# Altium schematic sheet hv-supply.SchDoc
size A; SheetNumber: 9; SheetTotal: 9
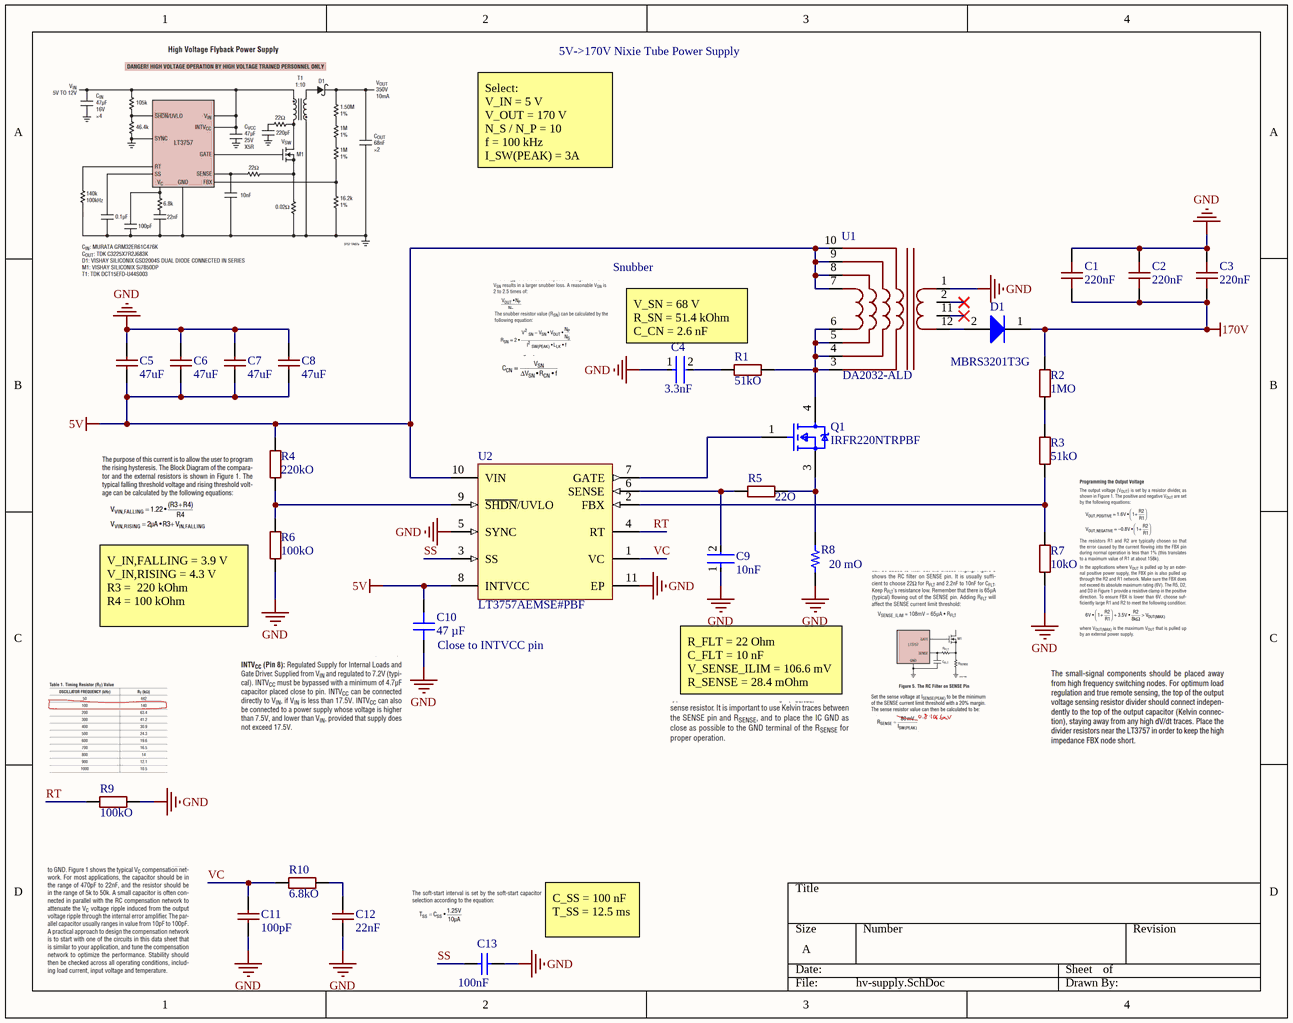
[diagram p0: hv-supply.SchDoc]

## Parts
C1  value 220nF  [1206B224K251NT]  (hidden comment: 1206B224K251NT)
C2  value 220nF  [1206B224K251NT]  (hidden comment: 1206B224K251NT)
C3  value 220nF  [1206B224K251NT]  (hidden comment: 1206B224K251NT)
C4  Capacitance: 3.3nF  [FP-CL388-IPC_C]  (hidden comment: CL05B332KB5NNNC)
C5  value 47uF  [CL21A476MQYNNNE]  (hidden comment: CL21A476MQYNNNE)
C6  value 47uF  [CL21A476MQYNNNE]  (hidden comment: CL21A476MQYNNNE)
C7  value 47uF  [CL21A476MQYNNNE]  (hidden comment: CL21A476MQYNNNE)
C8  value 47uF  [CL21A476MQYNNNE]  (hidden comment: CL21A476MQYNNNE)
C9  Capacitance: 10nF  [FP-CL165-IPC_C]  (hidden comment: CL05B103KB5NNNC)
C10  Capacitance: 47 µF  [CAP 0805_2012]  (hidden comment: CL21A476MQYNNNE)
C11  value 100pF  [0402CG101J500NT]  (hidden comment: 0402CG101J500NT)
C12  value 22nF  [0402B223K500NT]  (hidden comment: 0402B223K500NT)
C13  Capacitance: 100nF  [CAPC1050X55X23ML05T13]  (hidden comment: CL05B104KO5NNNC)
D1  MBRS3201T3G  [ONSC-SMC-2-403-03_V]
Q1  IRFR220NTRPBF  [FP-PG-TO252-3-MFG]
R1  value 51kO  [0402WGF5102TCE]  (hidden comment: 0402WGF5102TCE)
R2  value 1MO  [0402WGF1004TCE]  (hidden comment: 0402WGF1004TCE)
R3  value 51kO  [0402WGF5102TCE]  (hidden comment: 0402WGF5102TCE)
R4  value 220kO  [0603WAF2203T5E]  (hidden comment: 0603WAF2203T5E)
R5  value 22O  [0402WGF220JTCE]  (hidden comment: 0402WGF220JTCE)
R6  value 100kO  [0402WGF1003TCE]  (hidden comment: 0402WGF1003TCE)
R7  value 10kO  [0402WGF1002TCE]  (hidden comment: 0402WGF1002TCE)
R8  Resistance: 20 mO  [RES 0402_1005]  (hidden comment: PE0402FRF070R02L)
R9  value 100kO  [0402WGF1003TCE]  (hidden comment: 0402WGF1003TCE)
R10  value 6.8kO  [0402WGF6801TCE]  (hidden comment: 0402WGF6801TCE)
U1  DA2032-ALD  [DA2032-ALD]
U2  LT3757AEMSE#PBF  [LT-MSE-10-EDP_N]

## Nets
5V: C5.1 C6.1 C7.1 C8.1 C10.2 R4.2 U1.7 U1.8 U1.9 U1.10 U2.8(INTVCC) U2.10(VIN)
170V: C1.2 C2.2 C3.2 D1.1(K) R2.2
GND: C1.1 C2.1 C3.1 C4.1 C5.2 C6.2 C7.2 C8.2 C9.1 C10.1 C11.1 C12.1 C13.2 R6.1 R7.1 R8.1 R9.1 U1.1 U2.5(SYNC) U2.11(EP)
RT: R9.2 U2.4(RT)
SS: C13.1 U2.3(SS)
VC: C11.2 R10.1 U2.1(VC)
NetC4_2: C4.2 R1.2
NetC9_2: C9.2 R5.1 U2.6(SENSE)
NetC12_2: C12.2 R10.2
NetD1_2: D1.2(A) U1.12
NetQ1_1: Q1.1(GATE) U2.7(GATE)
NetQ1_3: Q1.3(SOURCE) R5.2 R8.2
NetQ1_4: Q1.4(DRAIN) R1.1 U1.3 U1.4 U1.5 U1.6
NetR2_1: R2.1 R3.2
NetR3_1: R3.1 R7.2 U2.2(FBX)
NetR4_1: R4.1 R6.2 U2.9(~{SHDN}/UVLO)

Not connected (* = marked no-connect by the designer): U1 2* 11*

## Notes on the sheet
- 5V->170V Nixie Tube Power Supply
- Select:
  V_IN = 5 V
  V_OUT = 170 V
  N_S / N_P = 10
  f = 100 kHz
  I_SW(PEAK) = 3A
- Snubber
- V_SN = 68 V
  R_SN = 51.4 kOhm
  C_CN = 2.6 nF
- (near R6) V_IN,FALLING = 3.9 V
  V_IN,RISING = 4.3 V
  R3 =  220 kOhm
  R4 = 100 kOhm
- (near C10) Close to INTVCC pin
- R_FLT = 22 Ohm
  C_FLT = 10 nF
  V_SENSE_ILIM = 106.6 mV
  R_SENSE = 28.4 mOhm
- C_SS = 100 nF
  T_SS = 12.5 ms

## Library data of the parts
C1-C3 = 1206B224K251NT: Multilayer Ceramic Capacitors MLCC - SMD/SMT. 220nF 250V X7R +/-10% 1206 Multilayer Ceramic Capacitors MLCC - SMD/SMT ROHS; Manufacturer: FH (Guangdong Fenghua Advanced Tech); Component Type: Capacitors; Design Item ID: 1206B224K251NT; JLCPCB Part #: C1322383; Manufacturer Part Number: 1206B224K251NT
C4 = CMP-13271-000627-1: Cap Ceramic 3.3nF 50V X7R ±10% SMD 0402 +125°C Paper T/R; Voltage Rating: 50V; Packaging: Tape and Reel; Mount: Surface Mount; Height: 0.5mm; Dielectric: X7R; Depth: 0.5mm; Tolerance: 10%; Voltage Rating (DC): 50V; Lead Free: Lead Free; Radiation Hardening: No; Thickness: 0.022inch; Case/Package: 0402; Width: 0.02inch; Contact Plating: Tin; Max Operating Temperature: 125°C; Length: 1mm; Case Code (Imperial): 0402; Voltage: 50V; Case Code (Metric): 1005; Min Operating Temperature: -55°C; Package Quantity: 1; Material: Ceramic
C5-C8 = CL21A476MQYNNNE: Multilayer Ceramic Capacitors MLCC - SMD/SMT. 47uF 6.3V X5R +/-20% 0805 Multilayer Ceramic Capacitors MLCC - SMD/SMT ROHS; Manufacturer: Samsung Electro-Mechanics; Component Type: Capacitors; Design Item ID: CL21A476MQYNNNE; JLCPCB Part #: C16780; Manufacturer Part Number: CL21A476MQYNNNE
C9 = CMP-13271-000387-1: Cap Ceramic 10nF 50V X7R ±10% SMD 0402 +125°C Paper T/R; Depth: 0.5mm; Length: 1mm; Lead Free: Lead Free; Case Code (Metric): 1005; Width: 0.02inch; Min Operating Temperature: -55°C; Thickness: 0.022inch; Package Quantity: 1; Mount: Surface Mount; Height: 0.5mm; Voltage: 50V; Material: Ceramic; Tolerance: 10%; Case Code (Imperial): 0402; Radiation Hardening: No; Case/Package: 0402; Max Operating Temperature: 125°C; Voltage Rating (DC): 50V; Contact Plating: Tin; Packaging: Tape and Reel; Voltage Rating: 50V; Dielectric: X7R
C10 = CL21A476MQYNNNE: CAP CER 47UF 6.3V X5R 0805; manufacturer: Samsung Electro-Mechanics; Tolerance: ±20%; value: 47 µF; Part Number: CL21A476MQYNNNE; Applications: General Purpose; componentlink1description: Datasheet; componentlink1url: http://www.samsungsem.com/kr/support/product-search/mlcc/CL21A476MQYNNNE.jsp; componentlink2description: DigiKey Link; componentlink2url: https://www.digikey.com/en/products/detail/samsung-electro-mechanics/CL21A476MQYNNNE/3887510; Device Package: 0805 (2012 Metric); lastupdated: 4/6/2026 7:33:17 PM; Lifecycle Status: Active; Minimum Order: 1; Mounting Type: Surface Mount, MLCC; Operating Temperature: -55°C ~ 85°C; Package / Case: 0805 (2012 Metric); packaging: TapeAndReel; partid: 3143; Part Status: Active; price: 0.04; series: CL; Size / Dimension: 0.079" L x 0.049" W (2.00mm x 1.25mm); Supplier 1: DigiKey; Supplier Part Number 1: 1276-1852-1-ND; Temperature Coefficient: X5R; Thickness (Max): 0.057" (1.45mm); Voltage - Rated: 6.3V
C11 = 0402CG101J500NT: Multilayer Ceramic Capacitors MLCC - SMD/SMT. 100pF 50V C0G +/-5% 0402 Multilayer Ceramic Capacitors MLCC - SMD/SMT ROHS; Manufacturer: FH (Guangdong Fenghua Advanced Tech); Component Type: Capacitors; Design Item ID: 0402CG101J500NT; JLCPCB Part #: C1546; Manufacturer Part Number: 0402CG101J500NT
C12 = 0402B223K500NT: Multilayer Ceramic Capacitors MLCC - SMD/SMT. 22nF 50V X7R +/-10% 0402 Multilayer Ceramic Capacitors MLCC - SMD/SMT ROHS; Manufacturer: FH (Guangdong Fenghua Advanced Tech); Component Type: Capacitors; Design Item ID: 0402B223K500NT; JLCPCB Part #: C1532; Manufacturer Part Number: 0402B223K500NT
C13 = CMP-2000-05439-1: Chip Capacitor, 100 nF, +/- 10%, 16 V, -55 to 125 degC, 0402 (1005 Metric), RoHS, Tape and Reel; Manufacturer: Samsung Electro-Mechanics; Dielectric: X7R; Rated Voltage: 16V; Value: 100nF; Case Size/Dimension: 0402; Tolerance (%): ±10%; Manufacturer URL: http://www.samsungsem.com/global/index.jsp; Datasheet URL: https://datasheet.ciiva.com/29198/458718-da-01-en-vs-kondensator-0402-29198423.pdf; Datasheet Version: Nov-10
D1 = CMP-1055-00379-1: 200 V, 3 A Schottky Fast Soft-Recovery Power Rectifier, 2-Pin SMC, Pb-Free, Tape and Reel; Manufacturer: On Semiconductor; Configuration: Single; trr Max (ns): 35; IFSM Max (A): 100; PackageDescription: 2-Pin Small Molded Package, J-Bend Lead, Body 5.845 x 6.855 mm; ComponentLink2URL: http://www.onsemi.cn/pub_link/Collateral/MBRS3201T3-D.PDF; Packing: Tape and Reel; DatasheetVersion: Rev. 3; PartNumber: MBRS3201T3G; ComponentLink2Description: Datasheet; ComponentLink1URL: http://www.onsemi.com/; PackageVersion: Rev. E, 08/2005; PackageReference: SMC-2-403-03; ComponentLink1Description: Manufacturer URL; RoHS: TRUE; ComponentLink3Description: Package Specification; ComponentLink3URL: http://www.onsemi.com/pub_link/Collateral/403-03.PDF; Mounting Technology: Surface Mount
Q1 = CMP-32901-000070-1: MOSFET N-CH 200V 5A DPAK; Manufacturer: Infineon; Gate Charge At Vgs: 15nC @ 10V; Rthja Max: 110°C/W; Gate To Source Voltage: 20V; Pulse Drain Current: 20A; Threshold Vgs Max: 4V; Max Junction Temp: +175°C; Drain To Source Resistance: 600mΩ; Number Of N Channels: 1; Depletion Mode: False; Max Forward Diode Voltage: 1.3V; Turn On Delay Time: 6.4ns; Power Dissipation: 43W; Reverse Recovery Time: 90ns; Threshold Vgs Min: 2V; Reverse Recovery Charge: 320nC; Turn Off Delay Time: 20ns; Input Capacitace At Vds: 300pF @ 25V; Package: PG-TO252-3; Height: 2.52mm; RoHS: TRUE; Device Class L2: Transistors; Octopart: https://octopart.com/irfr220ntrpbf-infineon-65874086; Manufacturer Part Number: IRFR220NTRPBF; Digikey Description: MOSFET N-CH 200V 5A DPAK; ComponentLink2Description: Datasheet; Temperature Range Low: -55°C; Footprint Url: http://www.irf.com/package/hexfet/dpakfootprint.pdf; Device Class L1: Discrete Semiconductors; Continuous Drain Current: 5A; Category: Trans; Drain To Source Breakdown Voltage: 200V; Automotive: No; Lead Free: Yes; Drain To Source Voltage: 200V; Temperature Range High: +175°C; Device Class L3: MOSFETs; Number Of Channels: 1; ComponentLink2URL: https://www.infineon.com/dgdl/irfr220npbf.pdf?fileId=5546d462533600a40153562d8a7b206f; Temperature: -55°C to +175°C
R1 R3 = 0402WGF5102TCE: Resistors. -55C~+155C 50V 51kohm 62.5mW Thick Film Resistor +/-1% +/-100ppm/C 0402 Chip Resistor - Surface Mount ROHS; Manufacturer: UNI-ROYAL(Uniroyal Elec); Component Type: Resistors; Design Item ID: 0402WGF5102TCE; JLCPCB Part #: C25794; Manufacturer Part Number: 0402WGF5102TCE
R2 = 0402WGF1004TCE: Resistors. -55C~+155C 1Mohm 50V 62.5mW Thick Film Resistor +/-1% +/-100ppm/C 0402 Chip Resistor - Surface Mount ROHS; Manufacturer: UNI-ROYAL(Uniroyal Elec); Component Type: Resistors; Design Item ID: 0402WGF1004TCE; JLCPCB Part #: C26083; Manufacturer Part Number: 0402WGF1004TCE
R4 = 0603WAF2203T5E: Resistors. -55C~+155C 100mW 220kohm 75V Thick Film Resistor +/-1% +/-100ppm/C 0603 Chip Resistor - Surface Mount ROHS; Manufacturer: UNI-ROYAL(Uniroyal Elec); Component Type: Resistors; Design Item ID: 0603WAF2203T5E; JLCPCB Part #: C22961; Manufacturer Part Number: 0603WAF2203T5E
R5 = 0402WGF220JTCE: Resistors. -55C~+155C 22ohm 50V 62.5mW Thick Film Resistor +/-1% +/-100ppm/C 0402 Chip Resistor - Surface Mount ROHS; Manufacturer: UNI-ROYAL(Uniroyal Elec); Component Type: Resistors; Design Item ID: 0402WGF220JTCE; JLCPCB Part #: C25092; Manufacturer Part Number: 0402WGF220JTCE
R6 R9 = 0402WGF1003TCE: Resistors. -55C~+155C 100kohm 50V 62.5mW Thick Film Resistor +/-1% +/-100ppm/C 0402 Chip Resistor - Surface Mount ROHS; Manufacturer: UNI-ROYAL(Uniroyal Elec); Component Type: Resistors; Design Item ID: 0402WGF1003TCE; JLCPCB Part #: C25741; Manufacturer Part Number: 0402WGF1003TCE
R7 = 0402WGF1002TCE: Resistors. -55C~+155C 10kohm 50V 62.5mW Thick Film Resistor +/-1% +/-100ppm/C 0402 Chip Resistor - Surface Mount ROHS; Manufacturer: UNI-ROYAL(Uniroyal Elec); Component Type: Resistors; Design Item ID: 0402WGF1002TCE; JLCPCB Part #: C25744; Manufacturer Part Number: 0402WGF1002TCE
R8 = PE0402FRF070R02L: RES 0.02 OHM 1% 1/16W 0402; Manufacturer: Yageo; Value: 20 mOhms; Power (Watts): 0.063W, 1/16W; Temperature Coefficient: ±100ppm/°C; Part Number: PE0402FRF070R02L; ComponentLink1Description: Datasheet; ComponentLink1URL: https://www.yageo.com/upload/media/product/productsearch/datasheet/rchip/PYu-PE_521_RoHS_L_10.pdf; ComponentLink2Description: DigiKey Link; ComponentLink2URL: https://www.digikey.com/en/products/detail/yageo/PE0402FRF070R02L/5913693; Composition: Metal Film; Device Package: 0402 (1005 Metric); Features: Automotive AEC-Q200, Current Sense; Height - Seated (Max): 0.020" (0.50mm); LastUpdated: 4/6/2026 7:41:00 PM; Lifecycle Status: Active; Minimum Order: 1; Number of Terminations: 2; Operating Temperature: -55°C ~ 125°C; Package / Case: 0402 (1005 Metric); Packaging: TapeAndReel; PartId: 59618; Part Status: Active; Price: 0.11; Ratings: AEC-Q200; Series: PE_L; Size / Dimension: 0.039" L x 0.020" W (1.00mm x 0.50mm); Supplier 1: DigiKey; Supplier Part Number 1: 13-PE0402FRF070R02LCT-ND; Supplier Device Package: 0402; Tolerance: ±1%
R10 = 0402WGF6801TCE: Resistors. -55C~+155C 50V 6.8kohm 62.5mW Thick Film Resistor +/-1% +/-100ppm/C 0402 Chip Resistor - Surface Mount ROHS; Manufacturer: UNI-ROYAL(Uniroyal Elec); Component Type: Resistors; Design Item ID: 0402WGF6801TCE; JLCPCB Part #: C25917; Manufacturer Part Number: 0402WGF6801TCE
U1 = DA2032-ALD: Audio Transformers. SMD-12 Audio Transformers ROHS; Manufacturer: Coilcraft; Component Type: Integrated Circuits; Design Item ID: DA2032-ALD; JLCPCB Part #: C7938441; Manufacturer Part Number: DA2032-ALD; Value: *
U2 = CMP-0491-01033-1: Boost, Flyback, SEPIC and Inverting Controller-Improved Load Transient, 10-pin SOP (MSE-10-EDP), -40 to 125 degC, Pb-Free; Manufacturer: Linear Technology; Frequency Adjust Range: 100kHz - 1MHz; Number of Outputs: 1; PackageVersion: Rev. I, 05/2013; PackageDescription: 10-Pin Plastic MSOP, Exposed Die Pad, Body 3 x 3 mm, Pitch 0.5 mm; PackageReference: MSE-10; DatasheetVersion: Rev. D; ComponentLink1Description: Manufacturer URL; PartNumber: LT3757AEMSE#PBF; ComponentLink2URL: http://cds.linear.com/docs/en/datasheet/3757Afd.pdf; RoHS: TRUE; ComponentLink3Description: Package Specification; ComponentLink1URL: http://www.linear.com/; Mounting Technology: Surface Mount; ComponentLink2Description: Datasheet; ComponentLink3URL: http://cds.linear.com/docs/en/packaging/05081664_I_MSE.pdf